# Altium project MVV_GOST.PrjPcb
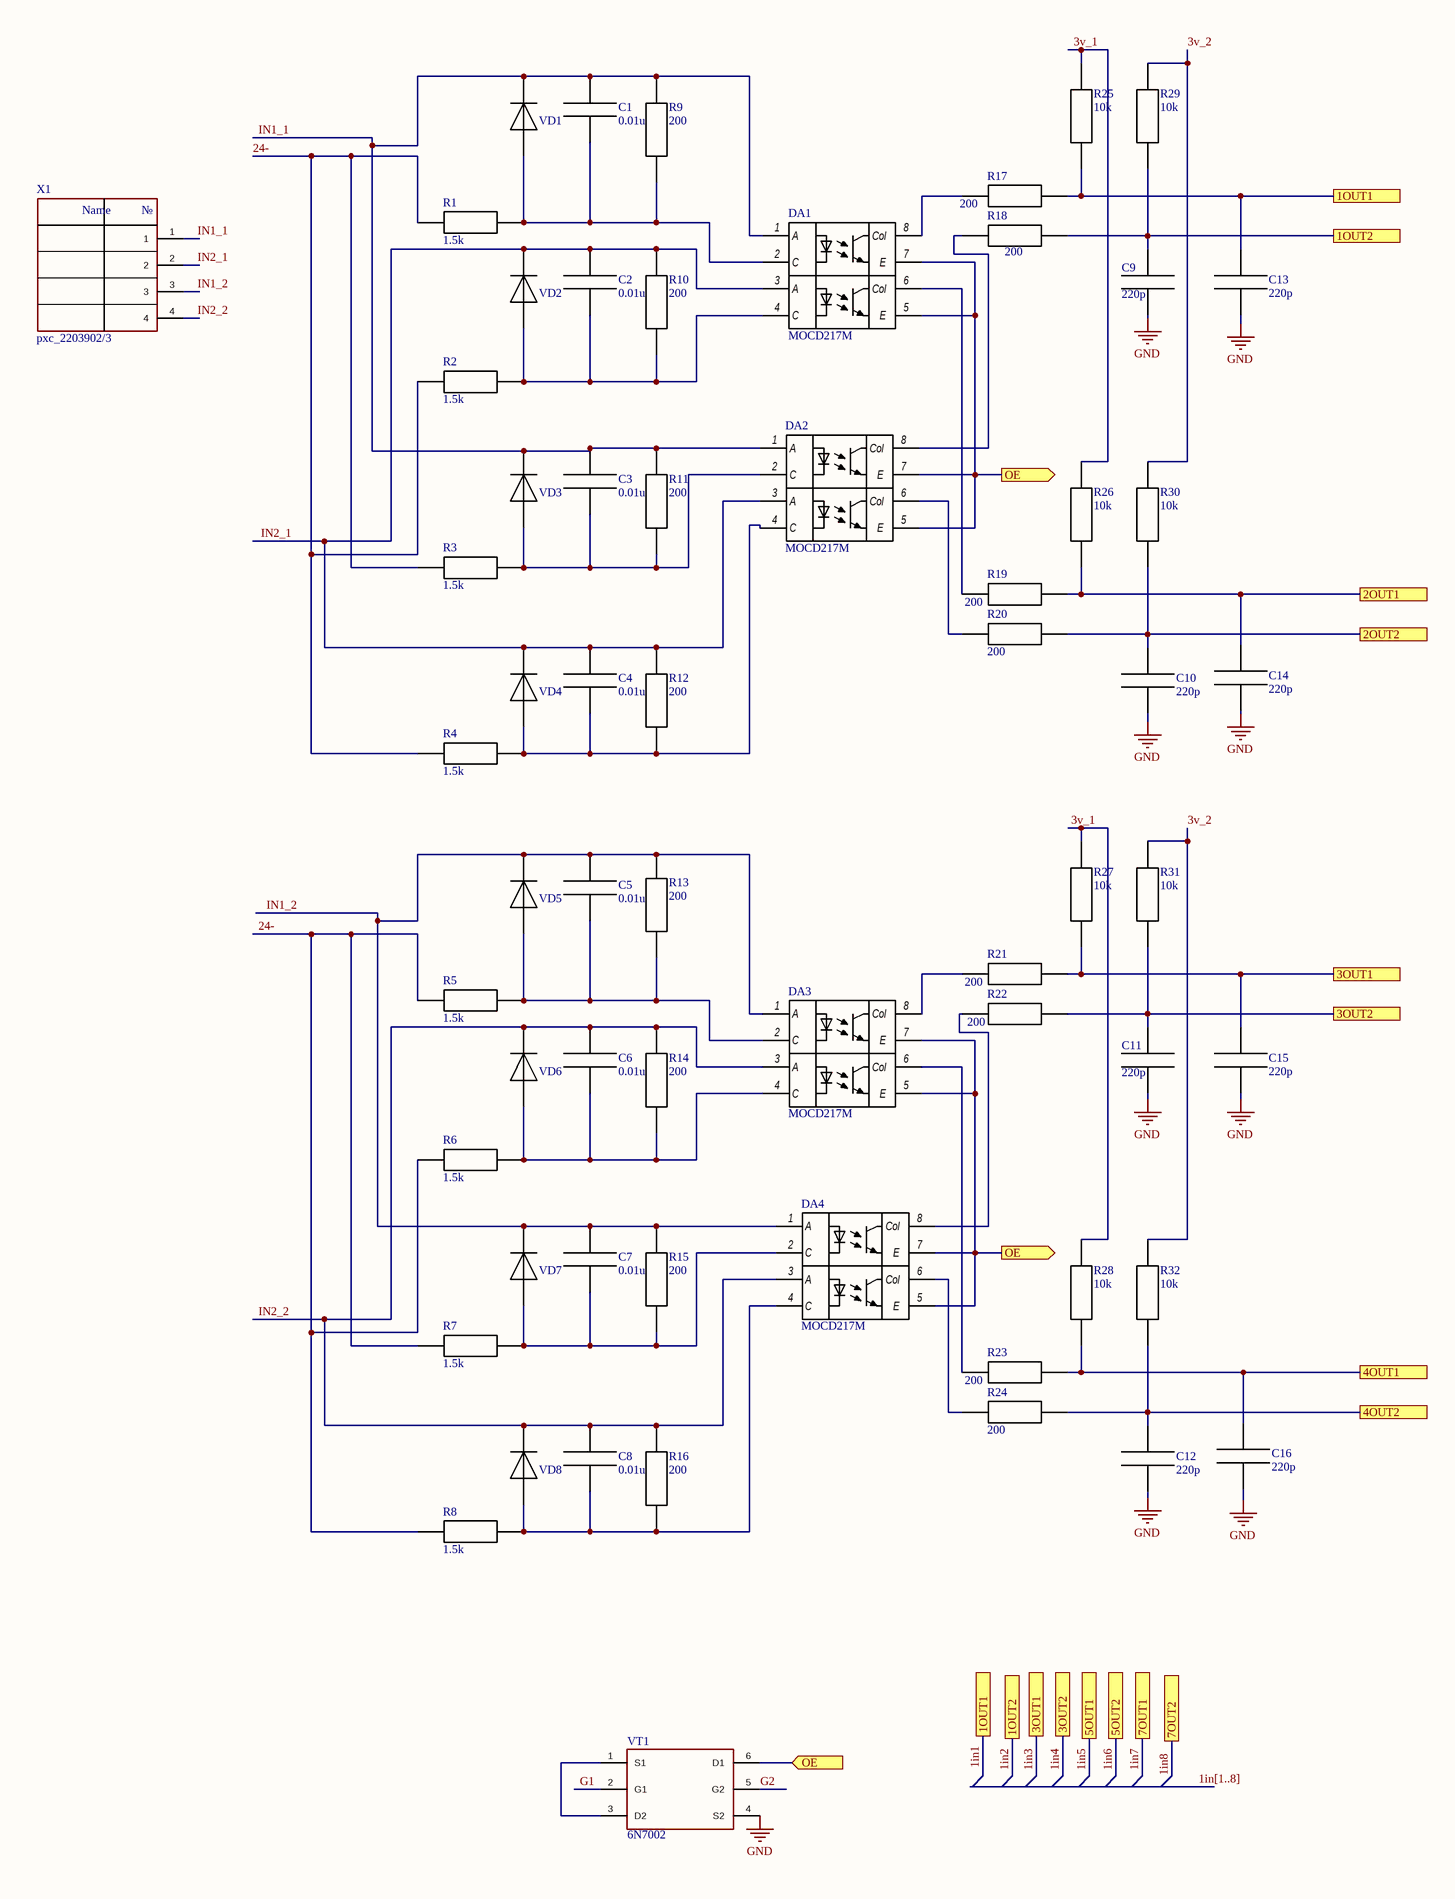
[diagram p0: Sheet1.SchDoc, left]
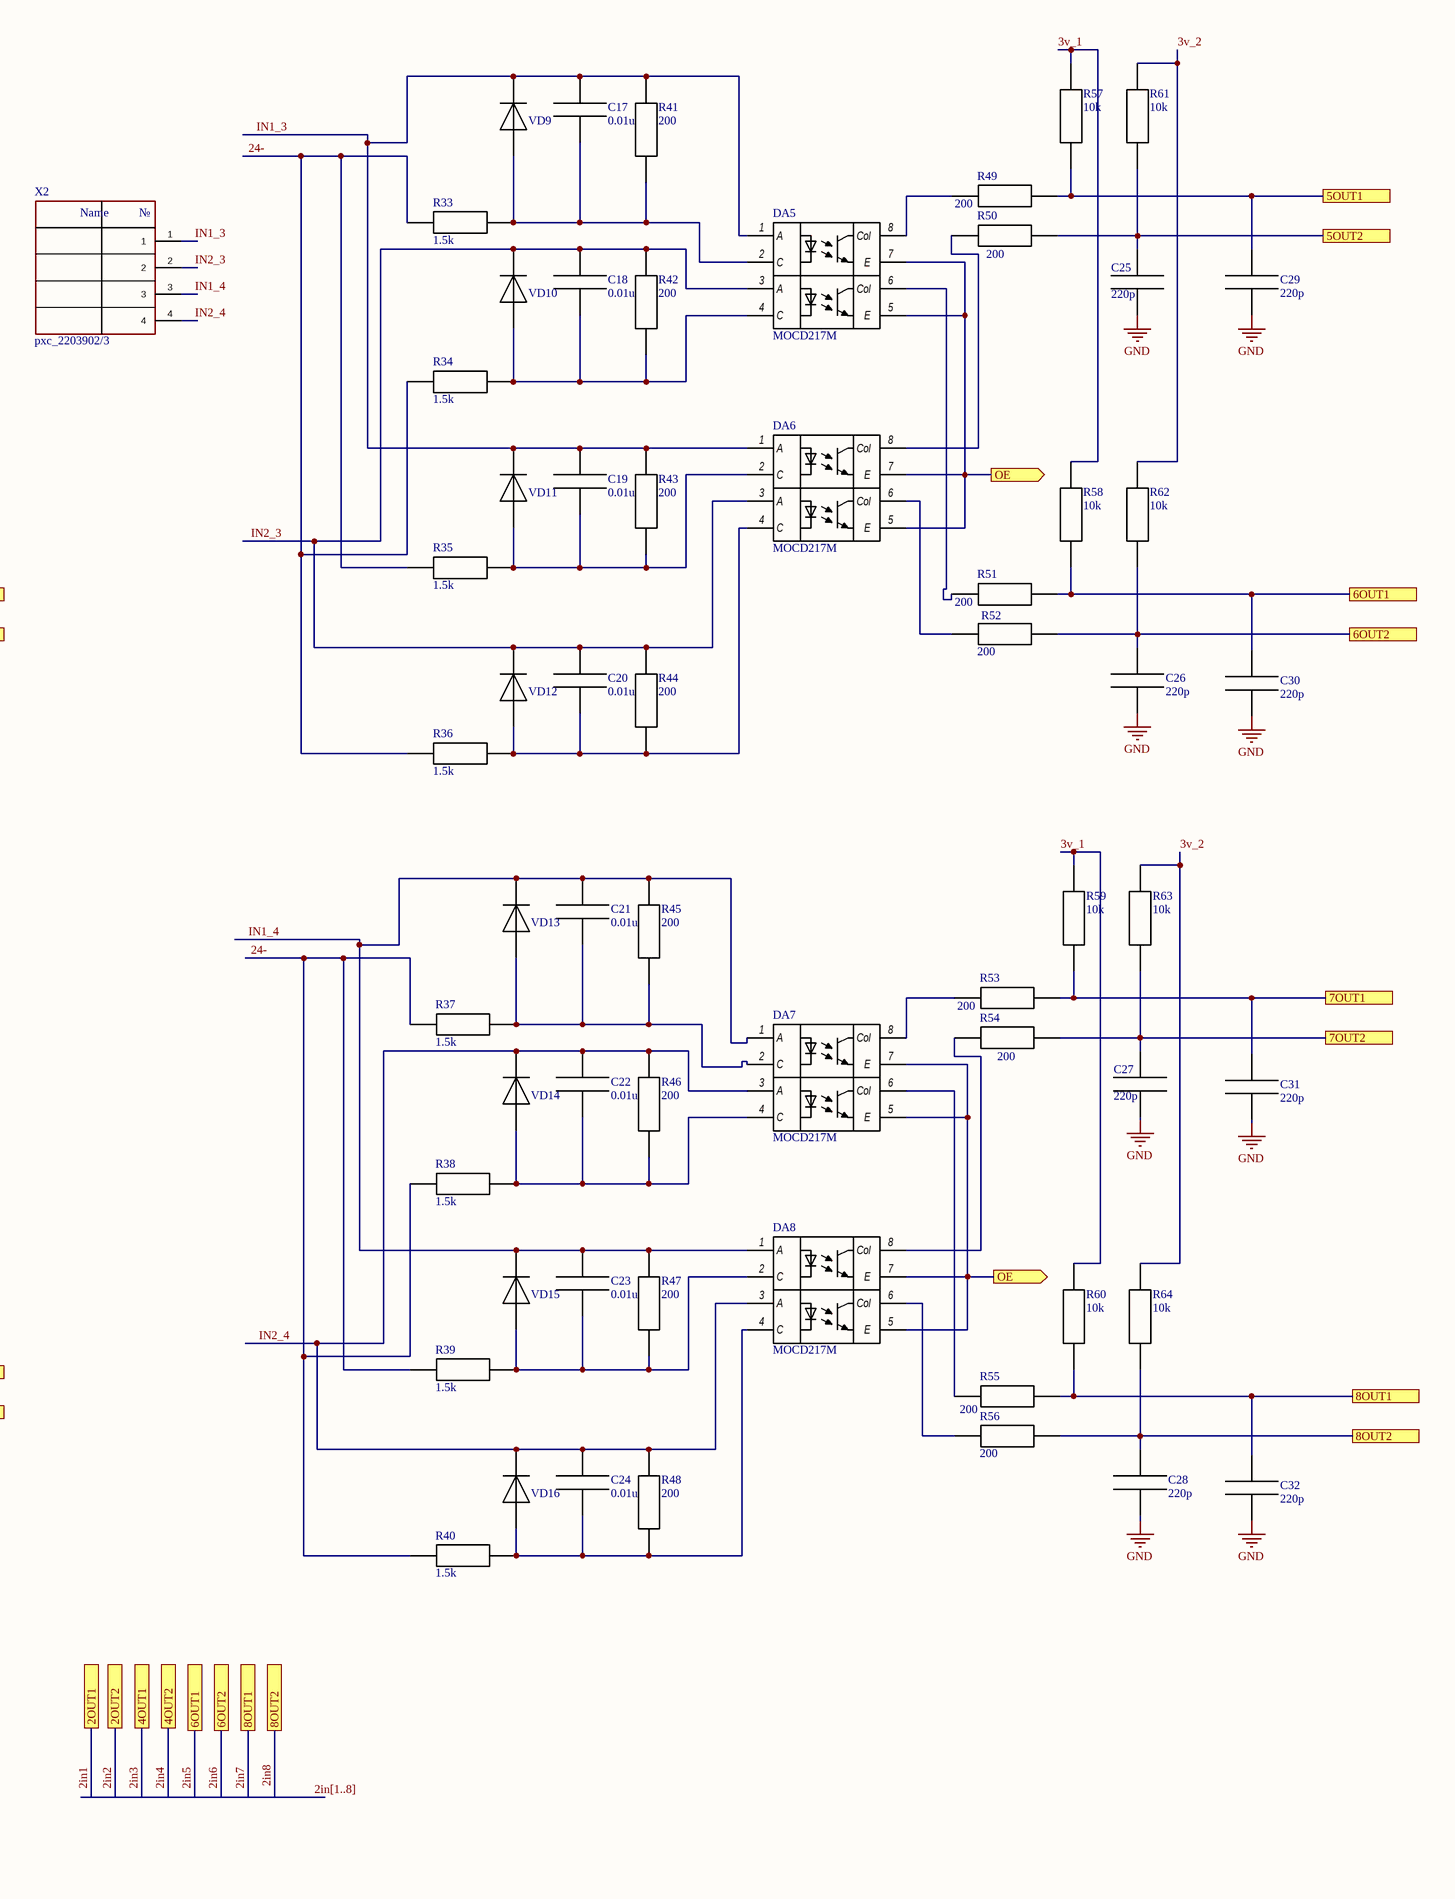
[diagram p1: Sheet1.SchDoc, right]
3 sheets, 306 parts. Net scope: global (net labels, ports and power ports of the same name join across sheets).
Board file: ЕРКФ.758725.093Д11_и1_МВВ.PcbDoc
Sheets:
  Sheet1.SchDoc
  Sheet2.SchDoc
  Sheet3.SchDoc

## Sheet Sheet1.SchDoc
size 594 x 420 mm; PageSetup: Record=PageOptions|CenterHorizontal=True|CenterVertical=True|PrintScale=0.94|XCorrection=1.00|YCorrection=1.00|PrintKind=1|BorderSize=5000000|LeftOffset=0|BottomOffset=0|Orientation=1|PaperLength=1000|PaperWidth=1000|Scale=100|PaperSource=7|PrintQuality=-4|MediaType=1|DitherType=10|PaperKind=A4|PrintScaleMode=1; DecimalNumber: Децимальный номер; HeadOfSector: Нач. сектора; MainDevice: Перв.примен.; Name: Наименование

### Parts
C1  0.01u  [0603_cap]
C2  0.01u  [0603_cap]
C3  0.01u  [0603_cap]
C4  0.01u  [0603_cap]
C5  0.01u  [0603_cap]
C6  0.01u  [0603_cap]
C7  0.01u  [0603_cap]
C8  0.01u  [0603_cap]
C9  220p  [cap_0402]
C10  220p  [cap_0402]
C11  220p  [cap_0402]
C12  220p  [cap_0402]
C13  220p  [cap_0402]
C14  220p  [cap_0402]
C15  220p  [cap_0402]
C16  220p  [cap_0402]
C17  0.01u  [0603_cap]
C18  0.01u  [0603_cap]
C19  0.01u  [0603_cap]
C20  0.01u  [0603_cap]
C21  0.01u  [0603_cap]
C22  0.01u  [0603_cap]
C23  0.01u  [0603_cap]
C24  0.01u  [0603_cap]
C25  220p  [cap_0402]
C26  220p  [cap_0402]
C27  220p  [cap_0402]
C28  220p  [cap_0402]
C29  220p  [cap_0402]
C30  220p  [cap_0402]
C31  220p  [cap_0402]
C32  220p  [cap_0402]
DA1  MOCD217M  [SO-8_optocup]
DA2  MOCD217M  [SO-8_optocup]
DA3  MOCD217M  [SO-8_optocup]
DA4  MOCD217M  [SO-8_optocup]
DA5  MOCD217M  [SO-8_optocup]
DA6  MOCD217M  [SO-8_optocup]
DA7  MOCD217M  [SO-8_optocup]
DA8  MOCD217M  [SO-8_optocup]
R1  1.5k  [2512_res]
R2  1.5k  [2512_res]
R3  1.5k  [2512_res]
R4  1.5k  [2512_res]
R5  1.5k  [2512_res]
R6  1.5k  [2512_res]
R7  1.5k  [2512_res]
R8  1.5k  [2512_res]
R9  200  [0603_res]
R10  200  [0603_res]
R11  200  [0603_res]
R12  200  [0603_res]
R13  200  [0603_res]
R14  200  [0603_res]
R15  200  [0603_res]
R16  200  [0603_res]
R17  200  [res_0402]
R18  200  [res_0402]
R19  200  [res_0402]
R20  200  [res_0402]
R21  200  [res_0402]
R22  200  [res_0402]
R23  200  [res_0402]
R24  200  [res_0402]
R25  10k  [res_0402]
R26  10k  [res_0402]
R27  10k  [res_0402]
R28  10k  [res_0402]
R29  10k  [res_0402]
R30  10k  [res_0402]
R31  10k  [res_0402]
R32  10k  [res_0402]
R33  1.5k  [2512_res]
R34  1.5k  [2512_res]
R35  1.5k  [2512_res]
R36  1.5k  [2512_res]
R37  1.5k  [2512_res]
R38  1.5k  [2512_res]
R39  1.5k  [2512_res]
R40  1.5k  [2512_res]
R41  200  [0603_res]
R42  200  [0603_res]
R43  200  [0603_res]
R44  200  [0603_res]
R45  200  [0603_res]
R46  200  [0603_res]
R47  200  [0603_res]
R48  200  [0603_res]
R49  200  [res_0402]
R50  200  [res_0402]
R51  200  [res_0402]
R52  200  [res_0402]
R53  200  [res_0402]
R54  200  [res_0402]
R55  200  [res_0402]
R56  200  [res_0402]
R57  10k  [res_0402]
R58  10k  [res_0402]
R59  10k  [res_0402]
R60  10k  [res_0402]
R61  10k  [res_0402]
R62  10k  [res_0402]
R63  10k  [res_0402]
R64  10k  [res_0402]
VD1  1N4448  [sod-323]  (value not drawn)
VD2  1N4448  [sod-323]  (value not drawn)
VD3  1N4448  [sod-323]  (value not drawn)
VD4  1N4448  [sod-323]  (value not drawn)
VD5  1N4448  [sod-323]  (value not drawn)
VD6  1N4448  [sod-323]  (value not drawn)
VD7  1N4448  [sod-323]  (value not drawn)
VD8  1N4448  [sod-323]  (value not drawn)
VD9  1N4448  [sod-323]  (value not drawn)
VD10  1N4448  [sod-323]  (value not drawn)
VD11  1N4448  [sod-323]  (value not drawn)
VD12  1N4448  [sod-323]  (value not drawn)
VD13  1N4448  [sod-323]  (value not drawn)
VD14  1N4448  [sod-323]  (value not drawn)
VD15  1N4448  [sod-323]  (value not drawn)
VD16  1N4448  [sod-323]  (value not drawn)
VT1  6N7002  [sot-23-6]
X1  pxc_2203902/3  [pxc_2203902]
X2  pxc_2203902/3  [pxc_2203902]

### Ports
1OUT1, 1OUT2, 2OUT1, 2OUT2, 3OUT1, 3OUT2, 4OUT1, 4OUT2, 5OUT1, 5OUT2, 6OUT1, 6OUT2, 7OUT1, 7OUT2, 8OUT1, 8OUT2, OE (in), OE (out)

### Nets
GND: C9.1 C10.1 C11.1 C12.1 C13.1 C14.1 C15.1 C16.1 C25.1 C26.1 C27.1 C28.1 C29.1 C30.1 C31.1 C32.1 VT1.4(S2)
1in1: C13.2 R17.2 R25.1 ; port 1OUT1
1in2: C9.2 R18.2 R29.1 ; port 1OUT2
1in3: C15.2 R21.2 R27.1 ; port 3OUT1
1in4: C11.2 R22.2 R31.1 ; port 3OUT2
1in5: C29.2 R49.2 R57.1 ; port 5OUT1
1in6: C25.2 R50.2 R61.1 ; port 5OUT2
1in7: C31.2 R53.2 R59.1 ; port 7OUT1
1in8: C27.2 R54.2 R63.1 ; port 7OUT2
2in1: C14.2 R19.2 R26.1 ; port 2OUT1
2in2: C10.2 R20.2 R30.1 ; port 2OUT2
2in3: C16.2 R23.2 R28.1 ; port 4OUT1
2in4: C12.2 R24.2 R32.1 ; port 4OUT2
2in5: C30.2 R51.2 R58.1 ; port 6OUT1
2in6: C26.2 R52.2 R62.1 ; port 6OUT2
2in7: C32.2 R55.2 R60.1 ; port 8OUT1
2in8: C28.2 R56.2 R64.1 ; port 8OUT2
3v_1: R25.2 R26.2 R27.2 R28.2 R57.2 R58.2 R59.2 R60.2
3v_2: R29.2 R30.2 R31.2 R32.2 R61.2 R62.2 R63.2 R64.2
24-: R1.1 R2.1 R3.1 R4.1 R5.1 R6.1 R7.1 R8.1 R33.1 R34.1 R35.1 R36.1 R37.1 R38.1 R39.1 R40.1
G1: VT1.2(G1)
G2: VT1.5(G2)
IN1_1: C1.2 C3.2 DA1.1(A) DA2.1(A) R9.2 R11.2 VD1.K VD3.K X1.1
IN1_2: C5.2 C7.2 DA3.1(A) DA4.1(A) R13.2 R15.2 VD5.K VD7.K X1.3
IN1_3: C17.2 C19.2 DA5.1(A) DA6.1(A) R41.2 R43.2 VD9.K VD11.K X2.1
IN1_4: C21.2 C23.2 DA7.1(A) DA8.1(A) R45.2 R47.2 VD13.K VD15.K X2.3
IN2_1: C2.2 C4.2 DA1.3(A) DA2.3(A) R10.2 R12.2 VD2.K VD4.K X1.2
IN2_2: C6.2 C8.2 DA3.3(A) DA4.3(A) R14.2 R16.2 VD6.K VD8.K X1.4
IN2_3: C18.2 C20.2 DA5.3(A) DA6.3(A) R42.2 R44.2 VD10.K VD12.K X2.2
IN2_4: C22.2 C24.2 DA7.3(A) DA8.3(A) R46.2 R48.2 VD14.K VD16.K X2.4
NetC1_1: C1.1 DA1.2(C) R1.2 R9.1 VD1.A
NetC2_1: C2.1 DA1.4(C) R2.2 R10.1 VD2.A
NetC3_1: C3.1 DA2.2(C) R3.2 R11.1 VD3.A
NetC4_1: C4.1 DA2.4(C) R4.2 R12.1 VD4.A
NetC5_1: C5.1 DA3.2(C) R5.2 R13.1 VD5.A
NetC6_1: C6.1 DA3.4(C) R6.2 R14.1 VD6.A
NetC7_1: C7.1 DA4.2(C) R7.2 R15.1 VD7.A
NetC8_1: C8.1 DA4.4(C) R8.2 R16.1 VD8.A
NetC17_1: C17.1 DA5.2(C) R33.2 R41.1 VD9.A
NetC18_1: C18.1 DA5.4(C) R34.2 R42.1 VD10.A
NetC19_1: C19.1 DA6.2(C) R35.2 R43.1 VD11.A
NetC20_1: C20.1 DA6.4(C) R36.2 R44.1 VD12.A
NetC21_1: C21.1 DA7.2(C) R37.2 R45.1 VD13.A
NetC22_1: C22.1 DA7.4(C) R38.2 R46.1 VD14.A
NetC23_1: C23.1 DA8.2(C) R39.2 R47.1 VD15.A
NetC24_1: C24.1 DA8.4(C) R40.2 R48.1 VD16.A
NetDA1_5: DA1.5(E) DA1.7(E) DA2.5(E) DA2.7(E) DA3.5(E) DA3.7(E) DA4.5(E) DA4.7(E) DA5.5(E) DA5.7(E) DA6.5(E) DA6.7(E) DA7.5(E) DA7.7(E) DA8.5(E) DA8.7(E) VT1.6(D1) ; port OE
NetDA1_6: DA1.6(Col) R19.1
NetDA1_8: DA1.8(Col) R17.1
NetDA2_6: DA2.6(Col) R20.1
NetDA2_8: DA2.8(Col) R18.1
NetDA3_6: DA3.6(Col) R23.1
NetDA3_8: DA3.8(Col) R21.1
NetDA4_6: DA4.6(Col) R24.1
NetDA4_8: DA4.8(Col) R22.1
NetDA5_6: DA5.6(Col) R51.1
NetDA5_8: DA5.8(Col) R49.1
NetDA6_6: DA6.6(Col) R52.1
NetDA6_8: DA6.8(Col) R50.1
NetDA7_6: DA7.6(Col) R55.1
NetDA7_8: DA7.8(Col) R53.1
NetDA8_6: DA8.6(Col) R56.1
NetDA8_8: DA8.8(Col) R54.1
NetVT1_1: VT1.1(S1) VT1.3(D2)

### Buses and harness runs
bus 1in[1..8] = 
bus 2in[1..8]

### Notes on the sheet
- Перв.примен.
- Справ.№
- Подп. и дата
- Инв.№ дубл.
- Взам.инв.№
- Подп.и дата
- Разраб.
- Изм.
- Лист
- № докум.
- Подп.
- Дата
- Лит.
- Масштаб
- Масса
- Т.контр.
- Пров.
- СХЕМА   ЭЛЕКТРИЧЕСКАЯ
- ПРИНЦИПИАЛЬНАЯ
- Листов
- Инв.№ подл.
- Утв.
- Н.контр.
- Нач.сект.
- Формат  A2
- (in symbol pxc_2203902/3) Name; №

### Library data of the parts
C1-C32 = cap
DA1-DA8 = MOCD217M: dual optopair
R1-R64 = res

## Sheet Sheet2.SchDoc
size 594 x 420 mm; PageSetup: Record=PageOptions|CenterHorizontal=True|CenterVertical=True|PrintScale=0.94|XCorrection=1.00|YCorrection=1.00|PrintKind=1|BorderSize=5000000|LeftOffset=0|BottomOffset=0|Orientation=1|PaperLength=1000|PaperWidth=1000|Scale=100|PaperSource=7|PrintQuality=-4|MediaType=1|DitherType=10|PaperKind=A4|PrintScaleMode=1; DecimalNumber: Децимальный номер; HeadOfSector: Нач. сектора; MainDevice: Перв.примен.; Name: Наименование
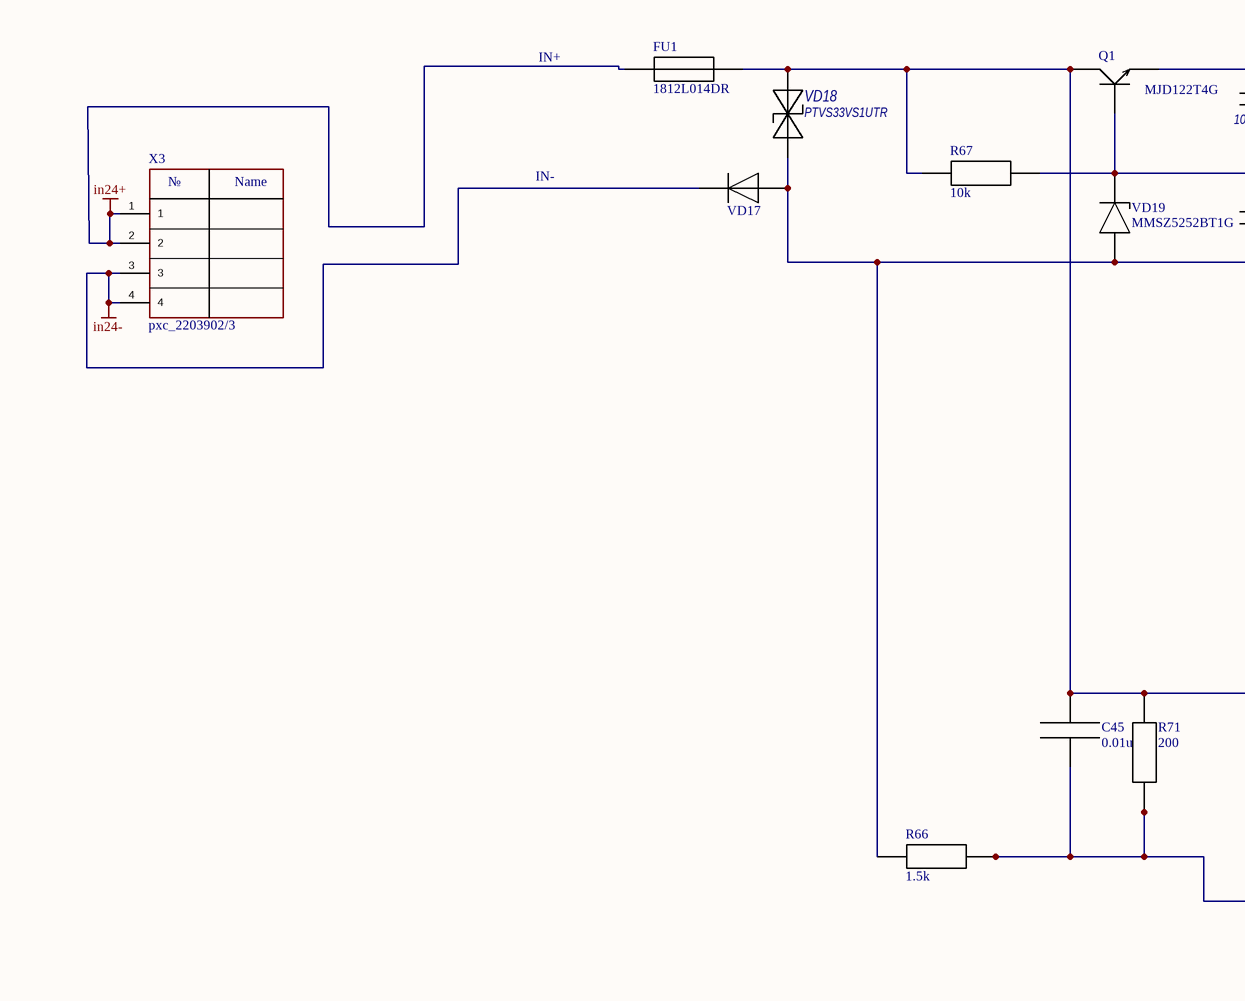
[diagram p2: Sheet2.SchDoc, top left]
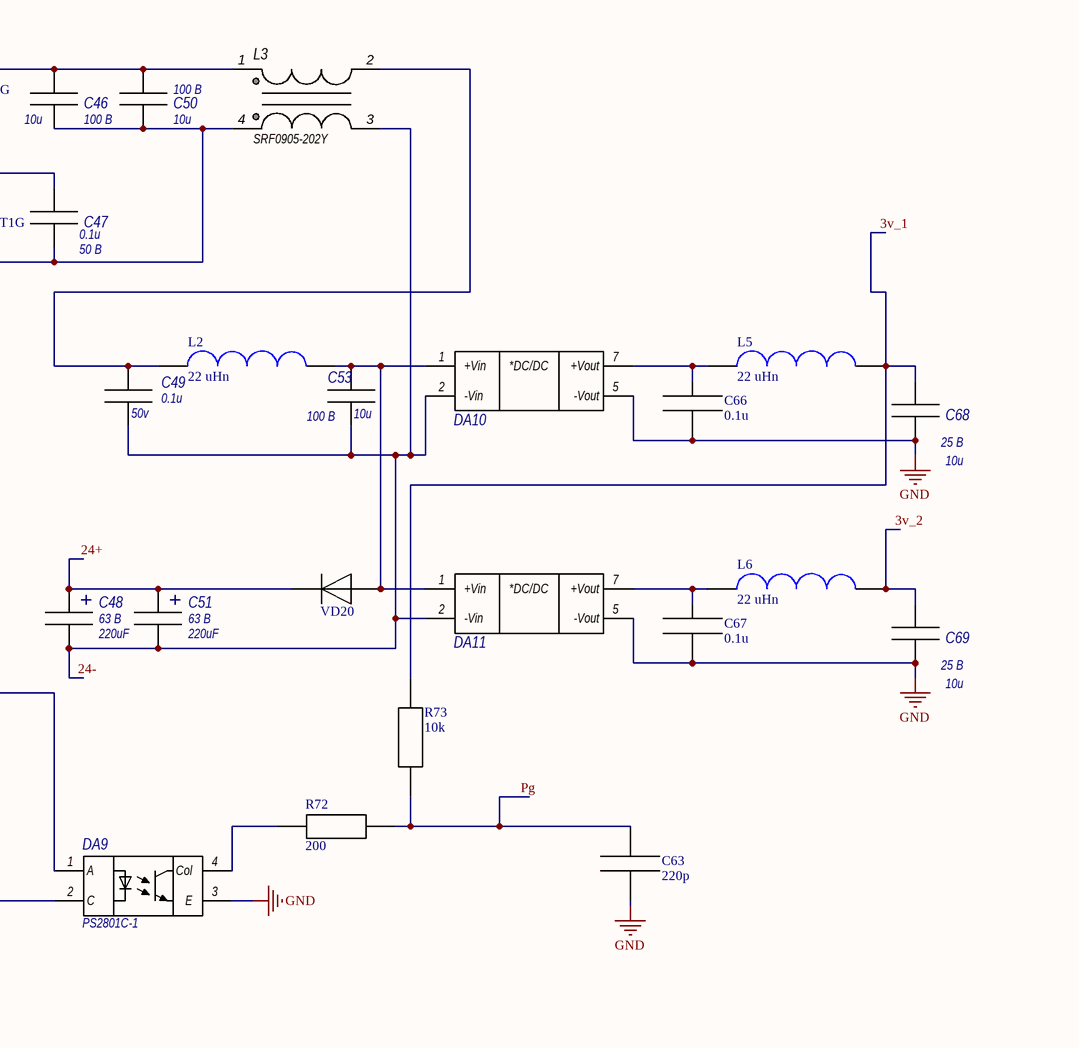
[diagram p3: Sheet2.SchDoc, top right]
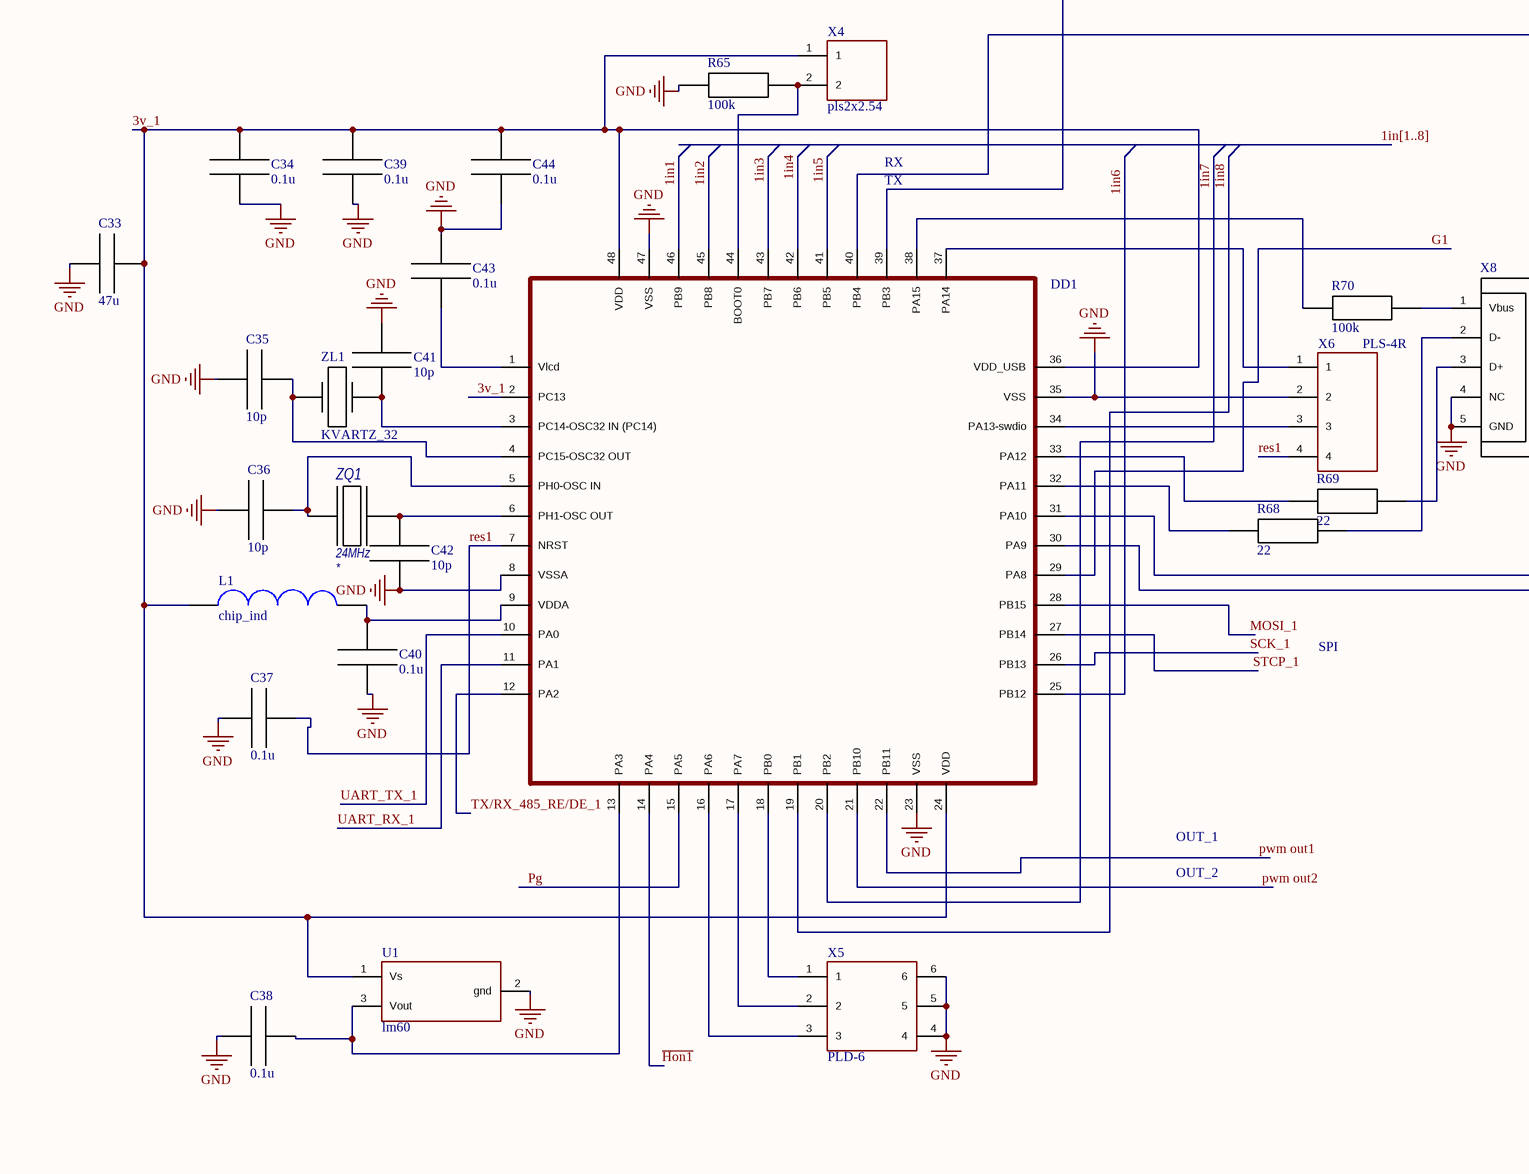
[diagram p4: Sheet2.SchDoc, bottom left]
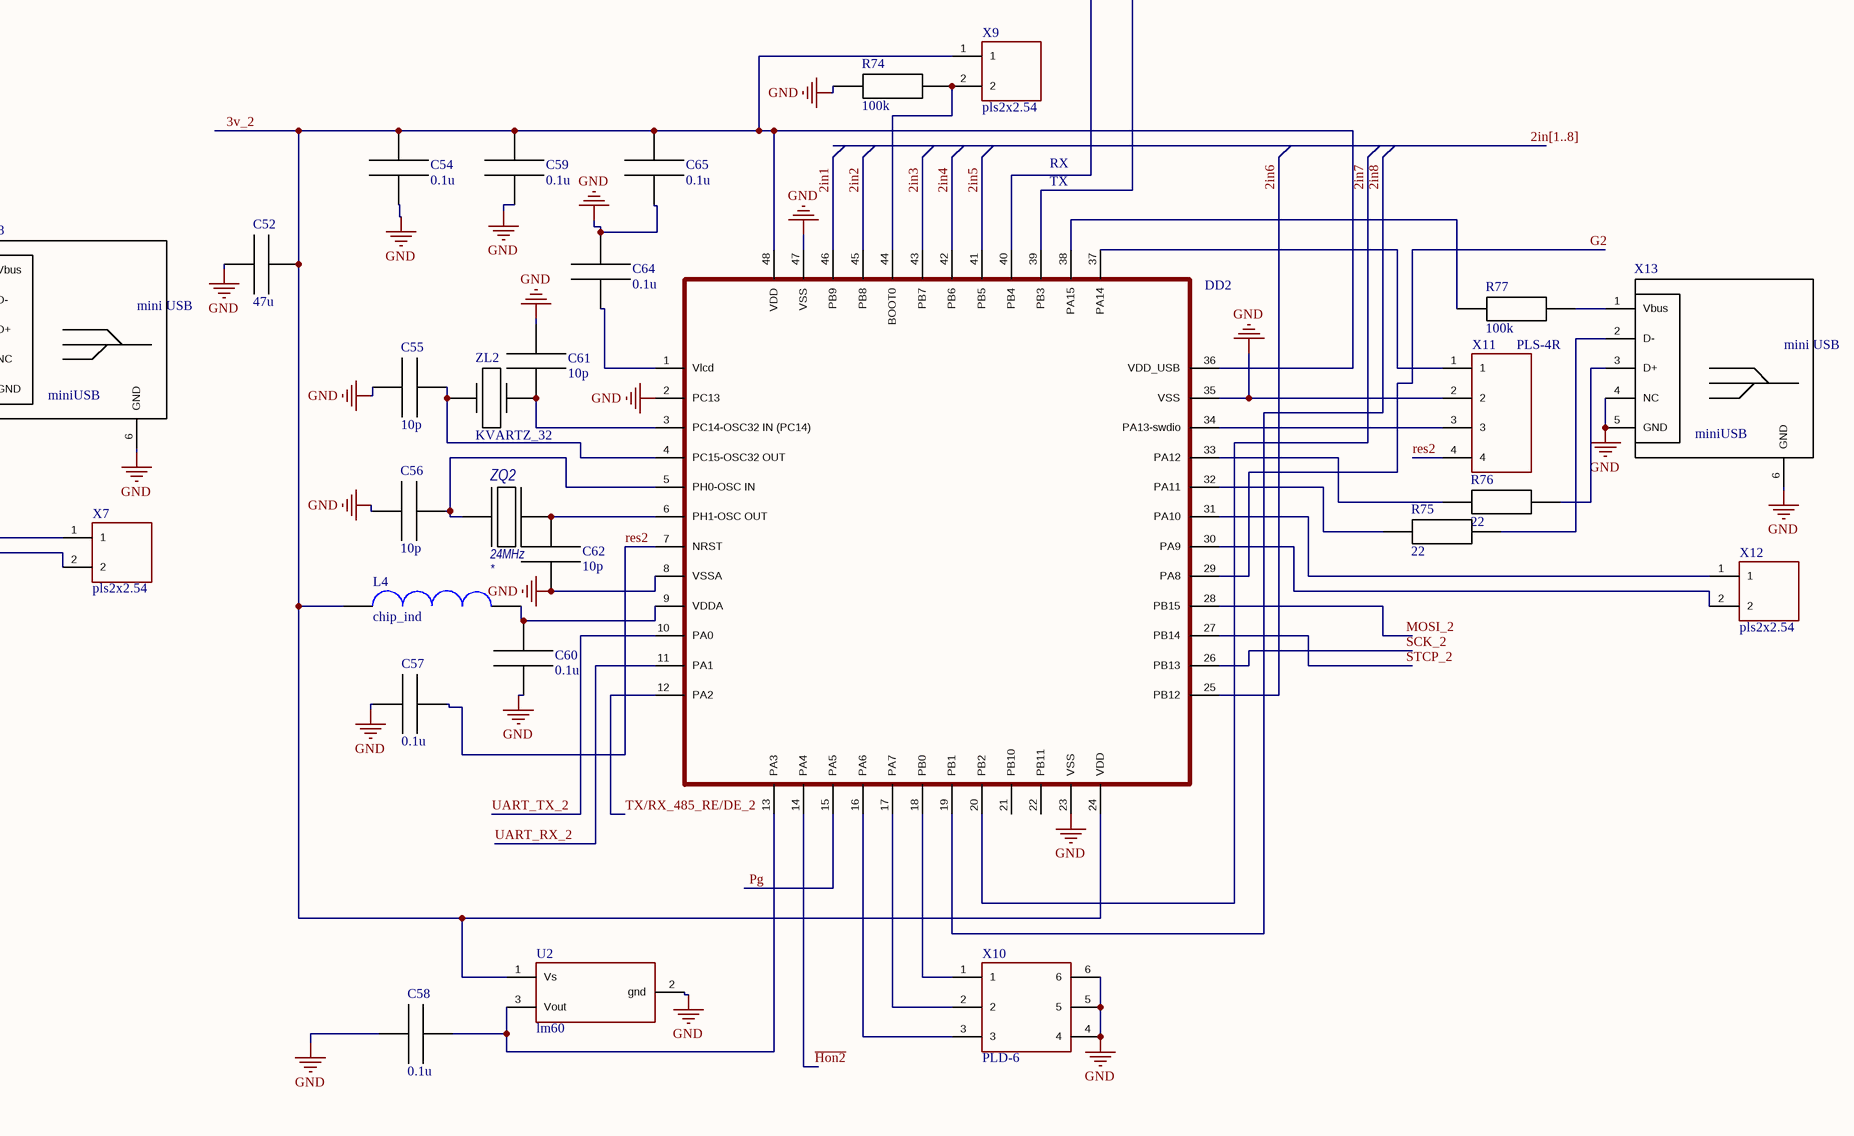
[diagram p5: Sheet2.SchDoc, bottom right]

### Parts
C33  47u  [1206-cap]
C34  0.1u  [cap_0402]
C35  10p  [cap_0402]
C36  10p  [cap_0402]
C37  0.1u  [cap_0402]
C38  0.1u  [cap_0402]
C39  0.1u  [cap_0402]
C40  0.1u  [cap_0402]
C41  10p  [cap_0402]
C42  10p  [cap_0402]
C43  0.1u  [cap_0402]
C44  0.1u  [cap_0402]
C45  0.01u  [0603_cap]
C46  value 10u  Voltage: 100 В  [C1206_]  (hidden comment: 10u 100v)
C47  Voltage: 50 В  [C0603]  (hidden comment: 0.1u)
C48  value 220uF  Voltage: 63 В  [rad_cap_10х12]  (hidden comment: 220u 63v)
C49  Voltage: 50v  [C0603]  (hidden comment: 0.1u)
C50  value 10u  Voltage: 100 В  [C1206_]  (hidden comment: 10u 100v)
C51  value 220uF  Voltage: 63 В  [rad_cap_10х12]  (hidden comment: 220u 63v)
C52  47u  [1206-cap]
C53  value 10u  Voltage: 100 В  [C1206_]  (hidden comment: 10u 100v)
C54  0.1u  [cap_0402]
C55  10p  [cap_0402]
C56  10p  [cap_0402]
C57  0.1u  [cap_0402]
C58  0.1u  [cap_0402]
C59  0.1u  [cap_0402]
C60  0.1u  [cap_0402]
C61  10p  [cap_0402]
C62  10p  [cap_0402]
C63  220p  [cap_0402]
C64  0.1u  [cap_0402]
C65  0.1u  [cap_0402]
C66  0.1u  [cap_0402]
C67  0.1u  [cap_0402]
C68  Voltage: 25 В  [C0603]  (hidden comment: 10u)
C69  Voltage: 25 В  [C0603]  (hidden comment: 10u)
DA9  PS2801C-1  [SSOP-4N]
DA10  AM1D-2403SH30Z  [AM1D-2405]  (value not drawn)
DA11  AM1D-2403SH30Z  [AM1D-2405]  (value not drawn)
DD1  STM32L073CBT6  [LQFP48]  (value not drawn)
DD2  STM32L073CBT6  [LQFP48]  (value not drawn)
FU1  1812L014DR  [fuse1210]
L1  chip_ind  [0603_ind]
L2  22 uHn  [ifsc1515]
L3  value SRF0905-202Y  [SRF0905]  (hidden comment: SRF0905)
L4  chip_ind  [0603_ind]
L5  22 uHn  [ifsc1515]
L6  22 uHn  [ifsc1515]
Q1  MJD122T4G  [sot23]
R65  100k  [res_0402]
R66  1.5k  [2512_res]
R67  10k  [0603_res]
R68  22  [res_0402]
R69  22  [res_0402]
R70  100k  [res_0402]
R71  200  [0603_res]
R72  200  [res_0402]
R73  10k  [res_0402]
R74  100k  [res_0402]
R75  22  [res_0402]
R76  22  [res_0402]
R77  100k  [res_0402]
U1  lm60  [sot23]
U2  lm60  [sot23]
VD17  1N4448W  [SOD-123]  (value not drawn)
VD18  PTVS33VS1UTR  [SOD-123]
VD19  MMSZ5252BT1G  [SOD-123]
VD20  1N4448W  [SOD-123]  (value not drawn)
X3  pxc_2203902/3  [pxc_2203903]
X4  pls2x2.54  [pls2x2.54]
X5  PLD-6  [PLD6]
X6  PLS-4R  [pls-4r]
X7  pls2x2.54  [pls2x2.54]
X8  miniUSB  [miniUSB]
X9  pls2x2.54  [pls2x2.54]
X10  PLD-6  [PLD6]
X11  PLS-4R  [pls-4r]
X12  pls2x2.54  [pls2x2.54]
X13  miniUSB  [miniUSB]
ZL1  KVARTZ_32  [zm206]
ZL2  KVARTZ_32  [zm206]
ZQ1  Type: 24MHz  [ECX-53B-DU]  (hidden comment: ESX-53-DU)
ZQ2  Type: 24MHz  [ECX-53B-DU]  (hidden comment: ESX-53-DU)

### Nets
GND: C33.1 C34.2 C35.1 C36.1 C37.1 C38.1 C39.1 C40.1 C41.2 C42.1 C43.2 C44.1 C52.1 C54.2 C55.1 C56.1 C57.1 C58.1 C59.1 C60.1 C61.2 C62.1 C63.2 C64.2 C65.1 C66.1 C67.1 C68.1 C69.1 DA9.3(E) DA10.5(-Vout) DA11.5(-Vout) DD1.8(VSSA) DD1.23(VSS) DD1.35(VSS) DD1.47(VSS) DD2.2(PC13) DD2.8(VSSA) DD2.23(VSS) DD2.35(VSS) DD2.47(VSS) R65.1 R74.1 U1.2(gnd) U2.2(gnd) X5.4 X5.5 X5.6 X6.2 X8.4(NC) X8.5(GND) X8.6(GND) X10.4 X10.5 X10.6 X11.2 X13.4(NC) X13.5(GND) X13.6(GND) ZQ1.2 ZQ1.4 ZQ2.2 ZQ2.4
in24+: FU1.1 X3.1 X3.2
in24-: VD17.K X3.3 X3.4
1in1: DD1.46(PB9)
1in2: DD1.45(PB8)
1in3: DD1.43(PB7)
1in4: DD1.42(PB6)
1in5: DD1.41(PB5)
1in6: DD1.25(PB12)
1in7: DD1.20(PB2)
1in8: DD1.19(PB1)
2in1: DD2.46(PB9)
2in2: DD2.45(PB8)
2in3: DD2.43(PB7)
2in4: DD2.42(PB6)
2in5: DD2.41(PB5)
2in6: DD2.25(PB12)
2in7: DD2.20(PB2)
2in8: DD2.19(PB1)
3v_1: C33.2 C34.1 C39.2 C44.2 C68.2 DD1.2(PC13) DD1.24(VDD) DD1.36(VDD_USB) DD1.48(VDD) L1.1 L5.2 R73.2 U1.1(Vs) X4.1
3v_2: C52.2 C54.1 C59.2 C65.2 C69.2 DD2.24(VDD) DD2.36(VDD_USB) DD2.48(VDD) L4.1 L6.2 U2.1(Vs) X9.1
24+: C48.1(A) C51.1(A) VD20.K
24-: C48.2(K) C49.1 C51.2(K) C53.1 DA10.2(-Vin) DA11.2(-Vin) L3.3
G1: DD1.29(PA8)
G2: DD2.29(PA8)
~{Hon1}: DD1.14(PA4)
~{Hon2}: DD2.14(PA4)
MOSI_1: DD1.28(PB15)
MOSI_2: DD2.28(PB15)
Pg: C63.1 DD1.15(PA5) DD2.15(PA5) R72.2 R73.1
pwm out1: DD1.22(PB11)
pwm out2: DD1.21(PB10)
res1: C37.2 DD1.7(NRST) X6.4
res2: C57.2 DD2.7(NRST) X11.4
SCK_1: DD1.26(PB13)
SCK_2: DD2.26(PB13)
STCP_1: DD1.27(PB14)
STCP_2: DD2.27(PB14)
TX/RX_485_RE/DE_1: DD1.12(PA2)
TX/RX_485_RE/DE_2: DD2.12(PA2)
UART_RX_1: DD1.11(PA1)
UART_RX_2: DD2.11(PA1)
UART_TX_1: DD1.10(PA0)
UART_TX_2: DD2.10(PA0)
NetC35_2: C35.2 DD1.4(PC15-OSC32_OUT) ZL1.2
NetC36_2: C36.2 DD1.5(PH0-OSC_IN) ZQ1.1
NetC38_2: C38.2 DD1.13(PA3) U1.3(Vout)
NetC40_2: C40.2 DD1.9(VDDA) L1.2
NetC41_1: C41.1 DD1.3(PC14-OSC32_IN_(PC14)) ZL1.1
NetC42_2: C42.2 DD1.6(PH1-OSC_OUT) ZQ1.3
NetC43_1: C43.1 DD1.1(Vlcd)
NetC45_1: C45.1 DA9.2(C) R66.2 R71.1
NetC45_2: C45.2 DA9.1(A) FU1.2 Q1.2(K) R67.1 R71.2 VD18.K
NetC46_1: C46.1 C47.1 C50.1 L3.4 R66.1 VD17.A VD18.A VD19.A
NetC46_2: C46.2 C50.2 L3.1 Q1.3(E)
NetC47_2: C47.2 Q1.1(B) R67.2 VD19.K
NetC49_2: C49.2 L2.1 L3.2
NetC53_2: C53.2 DA10.1(+Vin) DA11.1(+Vin) L2.2 VD20.A
NetC55_2: C55.2 DD2.4(PC15-OSC32_OUT) ZL2.2
NetC56_2: C56.2 DD2.5(PH0-OSC_IN) ZQ2.1
NetC58_2: C58.2 DD2.13(PA3) U2.3(Vout)
NetC60_2: C60.2 DD2.9(VDDA) L4.2
NetC61_1: C61.1 DD2.3(PC14-OSC32_IN_(PC14)) ZL2.1
NetC62_2: C62.2 DD2.6(PH1-OSC_OUT) ZQ2.3
NetC64_1: C64.1 DD2.1(Vlcd)
NetC66_2: C66.2 DA10.7(+Vout) L5.1
NetC67_2: C67.2 DA11.7(+Vout) L6.1
NetDA9_4: DA9.4(Col) R72.1
NetDD1_16: DD1.16(PA6) X5.3
NetDD1_17: DD1.17(PA7) X5.2
NetDD1_18: DD1.18(PB0) X5.1
NetDD1_30: DD1.30(PA9) X7.2
NetDD1_31: DD1.31(PA10) X7.1
NetDD1_32: DD1.32(PA11) R68.1
NetDD1_33: DD1.33(PA12) R69.1
NetDD1_34: DD1.34(PA13-swdio) X6.3
NetDD1_37: DD1.37(PA14) X6.1
NetDD1_38: DD1.38(PA15) R70.1
NetDD1_39: DD1.39(PB3) DD2.40(PB4)
NetDD1_40: DD1.40(PB4) DD2.39(PB3)
NetDD1_44: DD1.44(BOOT0) R65.2 X4.2
NetDD2_16: DD2.16(PA6) X10.3
NetDD2_17: DD2.17(PA7) X10.2
NetDD2_18: DD2.18(PB0) X10.1
NetDD2_30: DD2.30(PA9) X12.2
NetDD2_31: DD2.31(PA10) X12.1
NetDD2_32: DD2.32(PA11) R75.1
NetDD2_33: DD2.33(PA12) R76.1
NetDD2_34: DD2.34(PA13-swdio) X11.3
NetDD2_37: DD2.37(PA14) X11.1
NetDD2_38: DD2.38(PA15) R77.1
NetDD2_44: DD2.44(BOOT0) R74.2 X9.2
NetR68_2: R68.2 X8.2(D-)
NetR69_2: R69.2 X8.3(D+)
NetR70_2: R70.2 X8.1(Vbus)
NetR75_2: R75.2 X13.2(D-)
NetR76_2: R76.2 X13.3(D+)
NetR77_2: R77.2 X13.1(Vbus)

Not connected (* = marked no-connect by the designer): DD2 21(PB10) 22(PB11)

### Buses and harness runs
bus 1in[1..8]
bus 2in[1..8]

### Notes on the sheet
- IN+
- IN-
- TX
- RX
- SPI
- OUT_1
- OUT_2
- Подп. и дата
- Инв.№ дубл.
- Взам.инв.№
- Подп.и дата
- Инв.№ подл.
- Изм.
- Лист
- № докум.
- Подп.
- Дата
- Формат  A2
- (in symbol AM1D-2405SH30Z) *DC/DC
- (in symbol Capacitor electrolytic) +
- (in symbol miniUSB) mini USB
- (in symbol pxc_2203902/3) №; Name

### Library data of the parts
C33-C45 C52 C54-C67 = cap
C46 C50 C53 = Capacitor ceramic: Capacitance: 10u x 100 В; Dielectric: *; Tolerance: *
C47 = Capacitor ceramic: Capacitance: 0.1u x 50 В; Dielectric: *; Tolerance: *; Value: 0.1u
C48 = Capacitor electrolytic: Tolerance: ±20%; Polarization: Polar; Capacitance: 220uF x 63 В; Famile: Capacitor; Category: Capacitors; Operating Temperature: -40°C ~ 105°C; Package / Case: Radial, Can - SMD; ComponentLink1Description: Параметры; ComponentLink1URL: 5\res\Справочники\Конденсаторы\KEM_A4003_EXV.pdf; Dielectric: 63v
C49 = Capacitor ceramic: Capacitance: 0.1u x 50v; Dielectric: *; Tolerance: *; Value: 0.1u
C51 = Capacitor electrolytic: 10x12; Tolerance: ±20%; Polarization: Polar; Capacitance: 220uF x 63 В; Famile: Capacitor; Category: Capacitors; Operating Temperature: -40°C ~ 105°C; Package / Case: Radial, Can - SMD; ComponentLink1Description: Параметры; ComponentLink1URL: 5\res\Справочники\Конденсаторы\KEM_A4003_EXV.pdf; Dielectric: 63v
C68 C69 = Capacitor ceramic: Capacitance: 10u x 25 В; Dielectric: *; Tolerance: *; Value: 10u
DA10 DA11 = AM1D-2405SH30Z: AM1D-2403SH30Z 21.6-26.4V 3.3V 200mA 3000V 54мА 6мА 220мкF 77%
FU1 = fuse
L1 L4 = ind
L2 L5 L6 = ind_b82477g4
Q1 = npn
R65-R77 = res
VD17 VD20 = 1N4448
VD18 = PTVS33VS1UTR: PTVS33VS1UTR,115, TVS DIODE 33VWM 53.3VC SOD123W; Type: PTVS33VS1UTR
VD19 = stab: MMSZ5252BT1G, Стабилитрон 0.5Вт 24В
ZQ1 ZQ2 = REZONATOR: Crystal; Value: *
DA9 = PS2801C-1: Type: PS2801C-1

## Sheet Sheet3.SchDoc
size 594 x 420 mm; PageSetup: Record=PageOptions|CenterHorizontal=True|CenterVertical=True|PrintScale=0.94|XCorrection=1.00|YCorrection=1.00|PrintKind=1|BorderSize=5000000|LeftOffset=0|BottomOffset=0|Orientation=1|PaperLength=1000|PaperWidth=1000|Scale=100|PaperSource=7|PrintQuality=-4|MediaType=1|DitherType=10|PaperKind=A4|PrintScaleMode=1; DecimalNumber: Децимальный номер; HeadOfSector: Нач. сектора; MainDevice: Перв.примен.; Name: Наименование
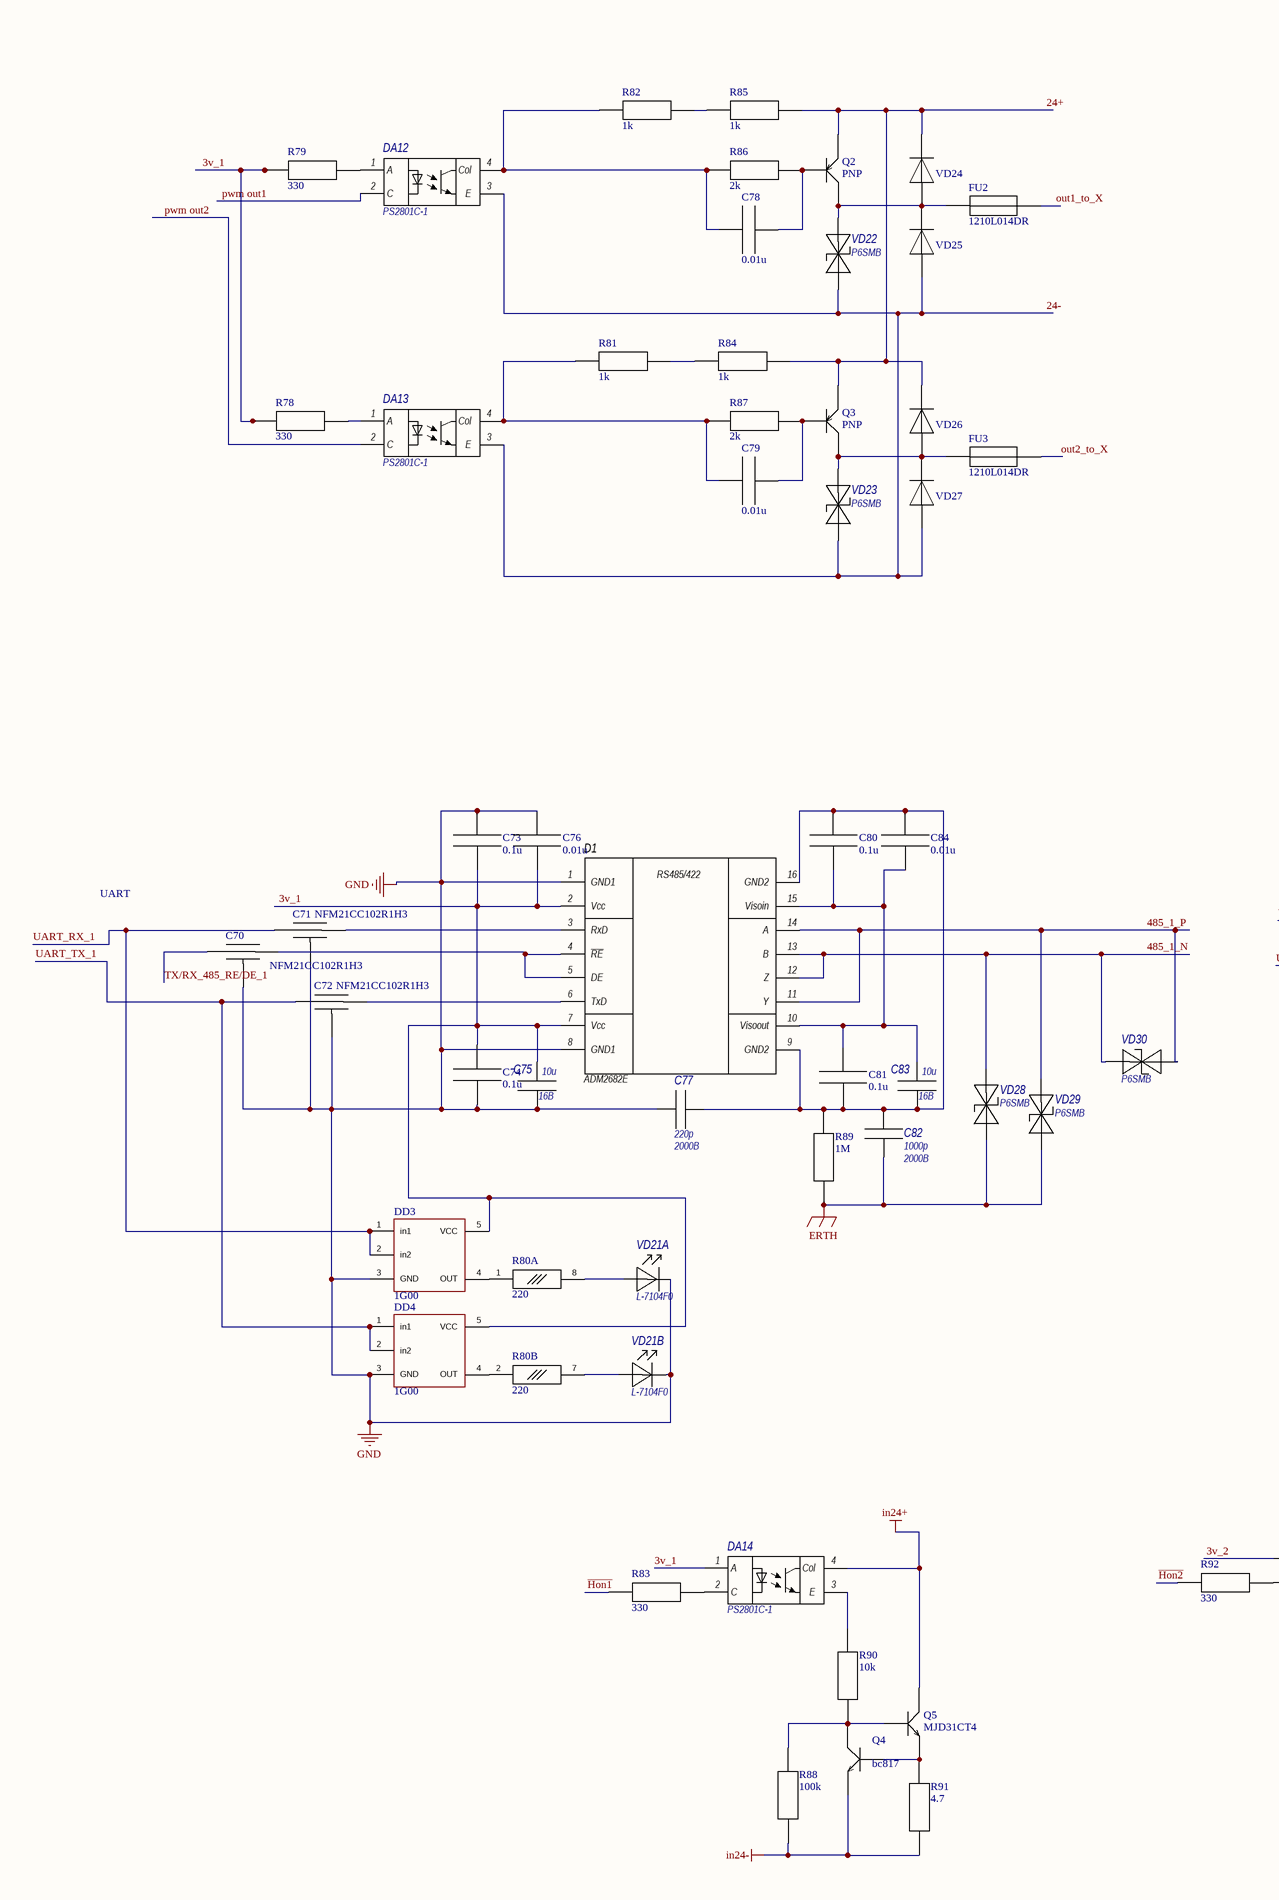
[diagram p6: Sheet3.SchDoc, left]
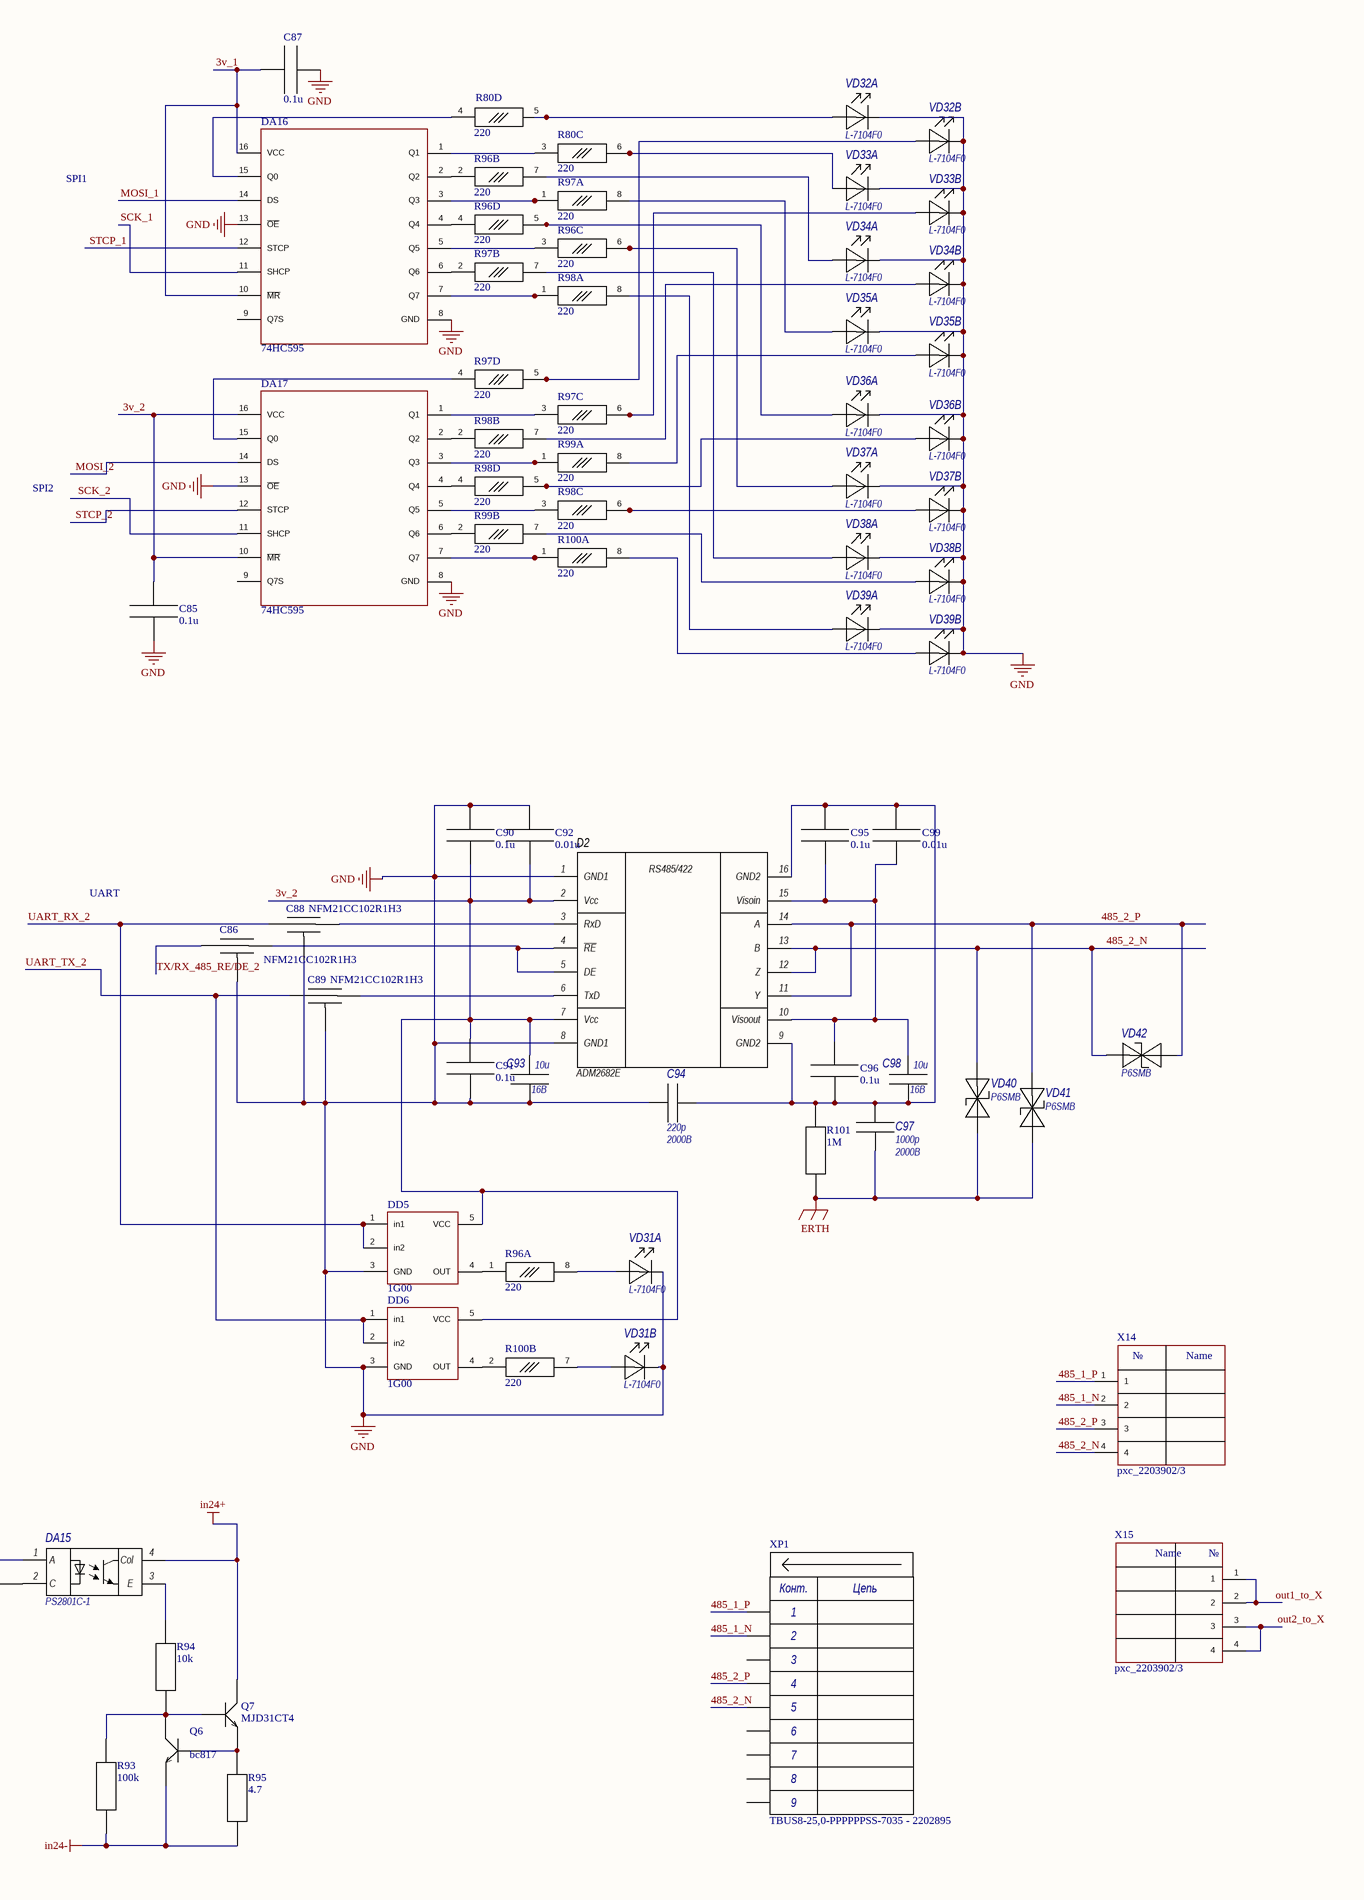
[diagram p7: Sheet3.SchDoc, right]

### Parts
C70  NFM21CC102R1H3  [NFM21C]
C71  NFM21CC102R1H3  [NFM21C]
C72  NFM21CC102R1H3  [NFM21C]
C73  0.1u  [cap_0402]
C74  0.1u  [cap_0402]
C75  value 10u  Voltage: 16В  [C0805_]  (hidden comment: 10u 16v)
C76  0.01u  [cap_0402]
C77  value 220p  Voltage: 2000В  [C1206_]  (hidden comment: 220p 2000v)
C78  0.01u  [cap_0402]
C79  0.01u  [cap_0402]
C80  0.1u  [cap_0402]
C81  0.1u  [cap_0402]
C82  value 1000p  Voltage: 2000В  [C1206_]  (hidden comment: 1000p 2000v)
C83  value 10u  Voltage: 16В  [C0805_]  (hidden comment: 10u 16v)
C84  0.01u  [cap_0402]
C85  0.1u  [cap_0402]
C86  NFM21CC102R1H3  [NFM21C]
C87  0.1u  [cap_0402]
C88  NFM21CC102R1H3  [NFM21C]
C89  NFM21CC102R1H3  [NFM21C]
C90  0.1u  [cap_0402]
C91  0.1u  [cap_0402]
C92  0.01u  [cap_0402]
C93  value 10u  Voltage: 16В  [C0805_]  (hidden comment: 10u 16v)
C94  value 220p  Voltage: 2000В  [C1206_]  (hidden comment: 220p 2000v)
C95  0.1u  [cap_0402]
C96  0.1u  [cap_0402]
C97  value 1000p  Voltage: 2000В  [C1206_]  (hidden comment: 1000p 2000v)
C98  value 10u  Voltage: 16В  [C0805_]  (hidden comment: 10u 16v)
C99  0.01u  [cap_0402]
D1  Type: ADM2682E  [SOIC_16IC_]  (hidden comment: ADM2682E_RS485_422_Isol)
D2  Type: ADM2682E  [SOIC_16IC_]  (hidden comment: ADM2682E_RS485_422_Isol)
DA12  PS2801C-1  [SSOP-4N]
DA13  PS2801C-1  [SSOP-4N]
DA14  PS2801C-1  [SSOP-4N]
DA15  PS2801C-1  [SSOP-4N]
DA16  74HC595  [TSSOP16]
DA17  74HC595  [TSSOP16]
DD3  1G00  [sot-23-5]
DD4  1G00  [sot-23-5]
DD5  1G00  [sot-23-5]
DD6  1G00  [sot-23-5]
FU2  1210L014DR  [fuse1210]
FU3  1210L014DR  [fuse1210]
Q2  PNP  [sot23]
Q3  PNP  [sot23]
Q4  bc817  [sot23]
Q5  MJD31CT4  [d-pak]
Q6  bc817  [sot23]
Q7  MJD31CT4  [d-pak]
R78  330  [res_0402]
R79  330  [res_0402]
R80  220  [YC164]  (parts A,B,C,D of 4)
R81  1k  [0805-res]
R82  1k  [0805-res]
R83  330  [res_0402]
R84  1k  [0805-res]
R85  1k  [0805-res]
R86  2k  [res_0402]
R87  2k  [res_0402]
R88  100k  [0805-res]
R89  1M  [0805-res]
R90  10k  [0805-res]
R91  4.7  [2512_res]
R92  330  [res_0402]
R93  100k  [0805-res]
R94  10k  [0805-res]
R95  4.7  [2512_res]
R96  220  [YC164]  (parts A,B,C,D of 4)
R97  220  [YC164]  (parts A,B,C,D of 4)
R98  220  [YC164]  (parts A,B,C,D of 4)
R99  220  [YC164]  (parts A,B of 4)
R100  220  [YC164]  (parts A,B of 4)
R101  1M  [0805-res]
VD21  Type: L-7104F0  [L-7104_]  (hidden comment: Diod_sv_L-7104F0)  (parts A,B of 2)
VD22  Type: P6SMB  [SOD-123]  (hidden comment: PTVS33VS1UTR)
VD23  Type: P6SMB  [SOD-123]  (hidden comment: PTVS33VS1UTR)
VD24  1N4448  [sod-323]  (value not drawn)
VD25  1N4448  [sod-323]  (value not drawn)
VD26  1N4448  [sod-323]  (value not drawn)
VD27  1N4448  [sod-323]  (value not drawn)
VD28  Type: P6SMB  [SOD-123]  (hidden comment: PTVS33VS1UTR)
VD29  Type: P6SMB  [SOD-123]  (hidden comment: PTVS33VS1UTR)
VD30  Type: P6SMB  [SOD-123]  (hidden comment: PTVS33VS1UTR)
VD31  Type: L-7104F0  [L-7104_]  (hidden comment: Diod_sv_L-7104F0)  (parts A,B of 2)
VD32  Type: L-7104F0  [L-7104_]  (hidden comment: Diod_sv_L-7104F0)  (parts A,B of 2)
VD33  Type: L-7104F0  [L-7104_]  (hidden comment: Diod_sv_L-7104F0)  (parts A,B of 2)
VD34  Type: L-7104F0  [L-7104_]  (hidden comment: Diod_sv_L-7104F0)  (parts A,B of 2)
VD35  Type: L-7104F0  [L-7104_]  (hidden comment: Diod_sv_L-7104F0)  (parts A,B of 2)
VD36  Type: L-7104F0  [L-7104_]  (hidden comment: Diod_sv_L-7104F0)  (parts A,B of 2)
VD37  Type: L-7104F0  [L-7104_]  (hidden comment: Diod_sv_L-7104F0)  (parts A,B of 2)
VD38  Type: L-7104F0  [L-7104_]  (hidden comment: Diod_sv_L-7104F0)  (parts A,B of 2)
VD39  Type: L-7104F0  [L-7104_]  (hidden comment: Diod_sv_L-7104F0)  (parts A,B of 2)
VD40  Type: P6SMB  [SOD-123]  (hidden comment: PTVS33VS1UTR)
VD41  Type: P6SMB  [SOD-123]  (hidden comment: PTVS33VS1UTR)
VD42  Type: P6SMB  [SOD-123]  (hidden comment: PTVS33VS1UTR)
X14  pxc_2203902/3  [pxc_2203903]
X15  pxc_2203902/3  [pxc_2203902]
XP1  TBUS8-25,0-PPPPPPSS-7035 - 2202895  [TBUS8-25,0-PPPPPPSS-7035 - 2202895]

### Nets
ERTH: C82.1 C97.1 R89.1 R101.1 VD28.A VD29.A VD40.A VD41.A
GND: C70.3(Gnd) C71.3(Gnd) C72.3(Gnd) C73.2 C74.1 C75.1 C76.2 C77.1 C85.1 C86.3(Gnd) C87.2 C88.3(Gnd) C89.3(Gnd) C90.2 C91.1 C92.1 C93.1 C94.1 D1.1(GND1) D1.8(GND1) D2.1(GND1) D2.8(GND1) DA16.8(GND) DA16.13(~{OE}) DA17.8(GND) DA17.13(~{OE}) DD3.3(GND) DD4.3(GND) DD5.3(GND) DD6.3(GND) VD21.2(K1) VD21.4(K2) VD31.2(K1) VD31.4(K2) VD32.2(K1) VD32.4(K2) VD33.2(K1) VD33.4(K2) VD34.2(K1) VD34.4(K2) VD35.2(K1) VD35.4(K2) VD36.2(K1) VD36.4(K2) VD37.2(K1) VD37.4(K2) VD38.2(K1) VD38.4(K2) VD39.2(K1) VD39.4(K2)
in24+: DA14.4(Col) DA15.4(Col) Q5.2(K) Q7.2(K)
in24-: Q4.3(E) Q6.3(E) R88.1 R91.1 R93.1 R95.1
3v_1: C73.1 C74.2 C75.2 C76.1 C87.1 D1.2(Vcc) D1.7(Vcc) DA14.1(A) DA16.10(~{MR}) DA16.16(VCC) DD3.5(VCC) DD4.5(VCC) R78.1 R79.1
3v_2: C85.2 C90.1 C91.2 C92.2 C93.2 D2.2(Vcc) D2.7(Vcc) DA15.1(A) DA17.10(~{MR}) DA17.16(VCC) DD5.5(VCC) DD6.5(VCC)
24+: Q2.3(K) Q3.3(K) R84.2 R85.2 VD24.K VD26.K
24-: DA12.3(E) DA13.3(E) VD22.A VD23.A VD25.A VD27.A
485_1_N: D1.12(Z) D1.13(B) VD28.K VD30.K X14.2 XP1.2(2c)
485_1_P: D1.11(Y) D1.14(A) VD29.K VD30.A X14.1 XP1.1(1c)
485_2_N: D2.12(Z) D2.13(B) VD40.K VD42.K X14.4 XP1.5(5c)
485_2_P: D2.11(Y) D2.14(A) VD41.K VD42.A X14.3 XP1.4(4c)
~{Hon1}: R83.1
~{Hon2}: R92.1
MOSI_1: DA16.14(DS)
MOSI_2: DA17.14(DS)
out1_to_X: FU2.2 X15.1 X15.2
out2_to_X: FU3.2 X15.3 X15.4
pwm out1: DA12.2(C)
pwm out2: DA13.2(C)
SCK_1: DA16.11(SHCP)
SCK_2: DA17.11(SHCP)
STCP_1: DA16.12(STCP)
STCP_2: DA17.12(STCP)
TX/RX_485_RE/DE_1: C70.1(in)
TX/RX_485_RE/DE_2: C86.1(in)
UART_RX_1: C71.1(in) DD3.1(in1) DD3.2(in2)
UART_RX_2: C88.1(in) DD5.1(in1) DD5.2(in2)
UART_TX_1: C72.1(in) DD4.1(in1) DD4.2(in2)
UART_TX_2: C89.1(in) DD6.1(in1) DD6.2(in2)
NetC70_2: C70.2(out) D1.4(~{RE}) D1.5(DE)
NetC71_2: C71.2(out) D1.3(RxD)
NetC72_2: C72.2(out) D1.6(TxD)
NetC77_2: C77.2 C80.2 C81.1 C82.2 C83.1 C84.2 D1.9(GND2) D1.16(GND2) R89.2
NetC78_1: C78.1 DA12.4(Col) R82.1 R86.1
NetC78_2: C78.2 Q2.1(B) R86.2
NetC79_1: C79.1 DA13.4(Col) R81.1 R87.1
NetC79_2: C79.2 Q3.1(B) R87.2
NetC80_1: C80.1 C81.2 C83.2 C84.1 D1.10(Visoout) D1.15(Visoin)
NetC86_2: C86.2(out) D2.4(~{RE}) D2.5(DE)
NetC88_2: C88.2(out) D2.3(RxD)
NetC89_2: C89.2(out) D2.6(TxD)
NetC94_2: C94.2 C95.2 C96.1 C97.2 C98.1 C99.2 D2.9(GND2) D2.16(GND2) R101.2
NetC95_1: C95.1 C96.2 C98.2 C99.1 D2.10(Visoout) D2.15(Visoin)
NetDA12_1: DA12.1(A) R79.2
NetDA13_1: DA13.1(A) R78.2
NetDA14_2: DA14.2(C) R83.2
NetDA14_3: DA14.3(E) R90.2
NetDA15_2: DA15.2(C) R92.2
NetDA15_3: DA15.3(E) R94.2
NetDA16_1: DA16.1(Q1) R80.3
NetDA16_2: DA16.2(Q2) R96.2
NetDA16_3: DA16.3(Q3) R97.1
NetDA16_4: DA16.4(Q4) R96.4
NetDA16_5: DA16.5(Q5) R96.3
NetDA16_6: DA16.6(Q6) R97.2
NetDA16_7: DA16.7(Q7) R98.1
NetDA16_15: DA16.15(Q0) R80.4
NetDA17_1: DA17.1(Q1) R97.3
NetDA17_2: DA17.2(Q2) R98.2
NetDA17_3: DA17.3(Q3) R99.1
NetDA17_4: DA17.4(Q4) R98.4
NetDA17_5: DA17.5(Q5) R98.3
NetDA17_6: DA17.6(Q6) R99.2
NetDA17_7: DA17.7(Q7) R100.1
NetDA17_15: DA17.15(Q0) R97.4
NetDD3_4: DD3.4(OUT) R80.1
NetDD4_4: DD4.4(OUT) R80.2
NetDD5_4: DD5.4(OUT) R96.1
NetDD6_4: DD6.4(OUT) R100.2
NetFU2_1: FU2.1 Q2.2(E) VD22.K VD24.A VD25.K
NetFU3_1: FU3.1 Q3.2(E) VD23.K VD26.A VD27.K
NetQ4_1: Q4.1(B) Q5.3(E) R91.2
NetQ4_2: Q4.2(K) Q5.1(B) R88.2 R90.1
NetQ6_1: Q6.1(B) Q7.3(E) R95.2
NetQ6_2: Q6.2(K) Q7.1(B) R93.2 R94.1
NetR80_5: R80.5 VD32.1(A1)
NetR80_6: R80.6 VD33.1(A1)
NetR80_7: R80.7 VD21.3(A2)
NetR80_8: R80.8 VD21.1(A1)
NetR81_2: R81.2 R84.1
NetR82_2: R82.2 R85.1
NetR96_5: R96.5 VD36.1(A1)
NetR96_6: R96.6 VD37.1(A1)
NetR96_7: R96.7 VD34.1(A1)
NetR96_8: R96.8 VD31.1(A1)
NetR97_5: R97.5 VD32.3(A2)
NetR97_6: R97.6 VD33.3(A2)
NetR97_7: R97.7 VD38.1(A1)
NetR97_8: R97.8 VD35.1(A1)
NetR98_5: R98.5 VD36.3(A2)
NetR98_6: R98.6 VD37.3(A2)
NetR98_7: R98.7 VD34.3(A2)
NetR98_8: R98.8 VD39.1(A1)
NetR99_7: R99.7 VD38.3(A2)
NetR99_8: R99.8 VD35.3(A2)
NetR100_7: R100.7 VD31.3(A2)
NetR100_8: R100.8 VD39.3(A2)

Not connected (* = marked no-connect by the designer): DA16 9(Q7S); DA17 9(Q7S); XP1 3(3c) 6(6c) 7(7e) 8(8e) 9

### Notes on the sheet
- SPI1
- SPI2
- UART
- Подп. и дата
- Инв.№ дубл.
- Взам.инв.№
- Подп.и дата
- Инв.№ подл.
- Изм.
- Лист
- № докум.
- Подп.
- Дата
- Формат  A2
- (in symbol ADM2682E_RS485_422_Isol) RS485/422
- (in symbol pxc_2203902/3) №; Name
- (in symbol TBUS8-25,0-PPPPPPSS-7035 - 2202895) Конт.; Цепь

### Library data of the parts
C70-C72 C86 C88 C89 = NFM21C
C73 C74 C76 C78-C81 C84 C85 C87 C90-C92 C95 C96 C99 = cap
C75 C83 C93 C98 = Capacitor ceramic: Capacitance: 10u x 16В; Dielectric: *; Tolerance: *
C77 C94 = Capacitor ceramic: Capacitance: 220p x 2000В; Dielectric: *; Tolerance: *
C82 C97 = Capacitor ceramic: Capacitance: 1000p x 2000В; Dielectric: *; Tolerance: *
DD3-DD6 = 1G00: 2NAND
FU2 FU3 = fuse
Q4 Q6 = npn
Q5 Q7 = npn: bc817
R78 R79 R81-R95 R101 = res
R80 R96-R100 = res_array: YC164
VD22 VD23 VD28-VD30 VD40-VD42 = PTVS33VS1UTR: as VD18 on sheet Sheet2
DA12-DA15 = PS2801C-1: Type: PS2801C-1
XP1 = TBUS8-25,0-PPPPPPSS-7035 - 2202895: Type: TBUS8-25,0-PPPPPPSS-7035 - 2202895

## Nets that join several sheets
GND: Sheet1 (17 pins), Sheet2 (63 pins), Sheet3 (50 pins)
in24+: Sheet2 (FU1.1 X3.1 X3.2), Sheet3 (DA14.4 DA15.4 Q5.2 Q7.2)
in24-: Sheet2 (VD17.K X3.3 X3.4), Sheet3 (6 pins)
1in1: Sheet1 (C13.2 R17.2 R25.1), Sheet2 (DD1.46)
1in2: Sheet1 (C9.2 R18.2 R29.1), Sheet2 (DD1.45)
1in3: Sheet1 (C15.2 R21.2 R27.1), Sheet2 (DD1.43)
1in4: Sheet1 (C11.2 R22.2 R31.1), Sheet2 (DD1.42)
1in5: Sheet1 (C29.2 R49.2 R57.1), Sheet2 (DD1.41)
1in6: Sheet1 (C25.2 R50.2 R61.1), Sheet2 (DD1.25)
1in7: Sheet1 (C31.2 R53.2 R59.1), Sheet2 (DD1.20)
1in8: Sheet1 (C27.2 R54.2 R63.1), Sheet2 (DD1.19)
2in1: Sheet1 (C14.2 R19.2 R26.1), Sheet2 (DD2.46)
2in2: Sheet1 (C10.2 R20.2 R30.1), Sheet2 (DD2.45)
2in3: Sheet1 (C16.2 R23.2 R28.1), Sheet2 (DD2.43)
2in4: Sheet1 (C12.2 R24.2 R32.1), Sheet2 (DD2.42)
2in5: Sheet1 (C30.2 R51.2 R58.1), Sheet2 (DD2.41)
2in6: Sheet1 (C26.2 R52.2 R62.1), Sheet2 (DD2.25)
2in7: Sheet1 (C32.2 R55.2 R60.1), Sheet2 (DD2.20)
2in8: Sheet1 (C28.2 R56.2 R64.1), Sheet2 (DD2.19)
3v_1: Sheet1 (8 pins), Sheet2 (14 pins), Sheet3 (14 pins)
3v_2: Sheet1 (8 pins), Sheet2 (12 pins), Sheet3 (12 pins)
24+: Sheet2 (C48.1 C51.1 VD20.K), Sheet3 (6 pins)
24-: Sheet1 (16 pins), Sheet2 (7 pins), Sheet3 (6 pins)
G1: Sheet1 (VT1.2), Sheet2 (DD1.29)
G2: Sheet1 (VT1.5), Sheet2 (DD2.29)
~{Hon1}: Sheet2 (DD1.14), Sheet3 (R83.1)
~{Hon2}: Sheet2 (DD2.14), Sheet3 (R92.1)
MOSI_1: Sheet2 (DD1.28), Sheet3 (DA16.14)
MOSI_2: Sheet2 (DD2.28), Sheet3 (DA17.14)
pwm out1: Sheet2 (DD1.22), Sheet3 (DA12.2)
pwm out2: Sheet2 (DD1.21), Sheet3 (DA13.2)
SCK_1: Sheet2 (DD1.26), Sheet3 (DA16.11)
SCK_2: Sheet2 (DD2.26), Sheet3 (DA17.11)
STCP_1: Sheet2 (DD1.27), Sheet3 (DA16.12)
STCP_2: Sheet2 (DD2.27), Sheet3 (DA17.12)
TX/RX_485_RE/DE_1: Sheet2 (DD1.12), Sheet3 (C70.1)
TX/RX_485_RE/DE_2: Sheet2 (DD2.12), Sheet3 (C86.1)
UART_RX_1: Sheet2 (DD1.11), Sheet3 (C71.1 DD3.1 DD3.2)
UART_RX_2: Sheet2 (DD2.11), Sheet3 (C88.1 DD5.1 DD5.2)
UART_TX_1: Sheet2 (DD1.10), Sheet3 (C72.1 DD4.1 DD4.2)
UART_TX_2: Sheet2 (DD2.10), Sheet3 (C89.1 DD6.1 DD6.2)